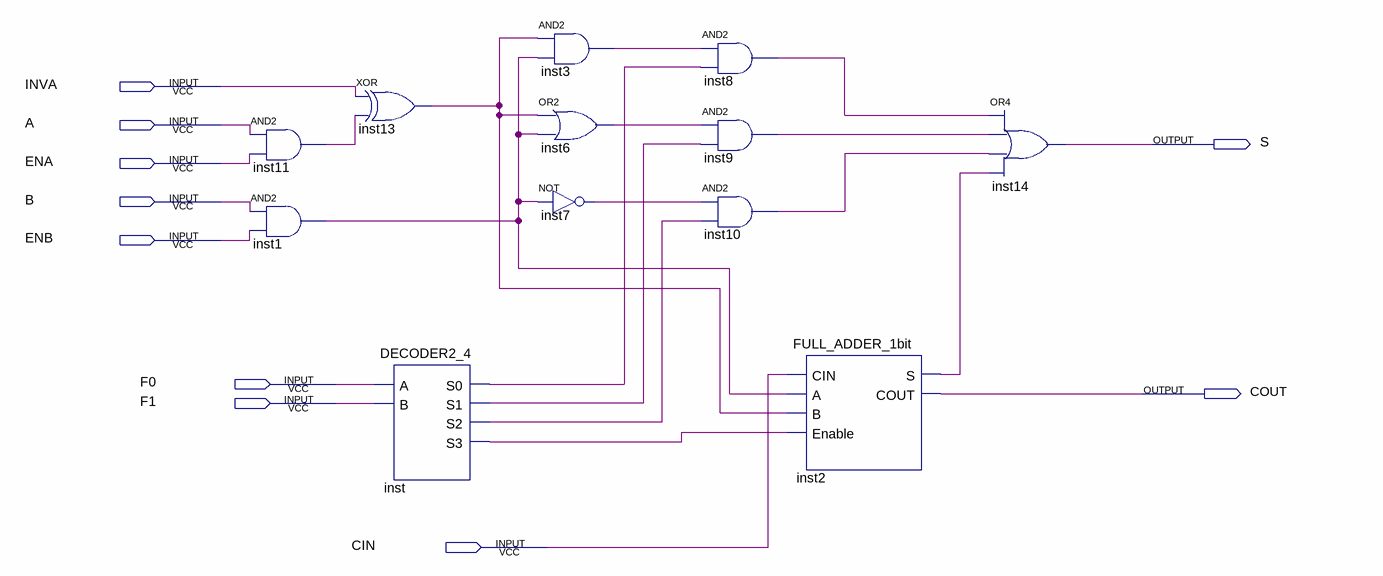
[diagram p0: schematic sheet]
// Quartus schematic ULA_1bit.bdf as structural Verilog: 12 symbols, 10 pins
module ULA_1bit (
  input  INVA,
  input  A,
  input  ENA,
  input  B,
  input  ENB,
  input  F0,
  input  F1,
  input  CIN,
  output S,
  output COUT
);

  wire inst1_out, inst2_s, inst3_out, inst6_out, inst7_out, inst8_out, inst9_out, inst10_out, inst11_out,
       inst13_out, inst_s0, inst_s1, inst_s2, inst_s3;

  and inst11 (inst11_out, A, ENA);
  and inst1 (inst1_out, B, ENB);
  xor inst13 (inst13_out, INVA, inst11_out);
  DECODER2_4 inst (.A(F0), .B(F1), .S0(inst_s0), .S1(inst_s1), .S2(inst_s2), .S3(inst_s3));
  and inst3 (inst3_out, inst13_out, inst1_out);
  or inst6 (inst6_out, inst13_out, inst1_out);
  not inst7 (inst7_out, inst1_out);
  and inst8 (inst8_out, inst3_out, inst_s0);
  and inst9 (inst9_out, inst6_out, inst_s1);
  and inst10 (inst10_out, inst7_out, inst_s2);
  FULL_ADDER_1bit inst2 (.CIN(CIN), .A(inst1_out), .B(inst13_out), .Enable(inst_s3), .S(inst2_s), .COUT(COUT));
  or inst14 (S, inst8_out, inst9_out, inst10_out, inst2_s);
endmodule
